# Altium schematic sheet ldr.SchDoc: DE:TMP:11:UC:EXPANDIDO
size 203 x 139 mm; Date: 21-07-2022; SheetNumber: 1; SheetTotal: 1; WebFGR: www.abebashop.com; VersionFGR: 20220721; PageSetup: Record=PageOptions|CenterHorizontal=True|CenterVertical=True|PrintScale=0.94|XCorrection=1.00|YCorrection=1.00|PrintKind=0|BorderSize=5000000|LeftOffset=0|BottomOffset=0|Orientation=2|PaperLength=1000|PaperWidth=1000|Scale=100|PaperSource=7|PrintQuality=-4|MediaType=1|DitherType=10|PaperKind=Letter|PrintScaleMode=1
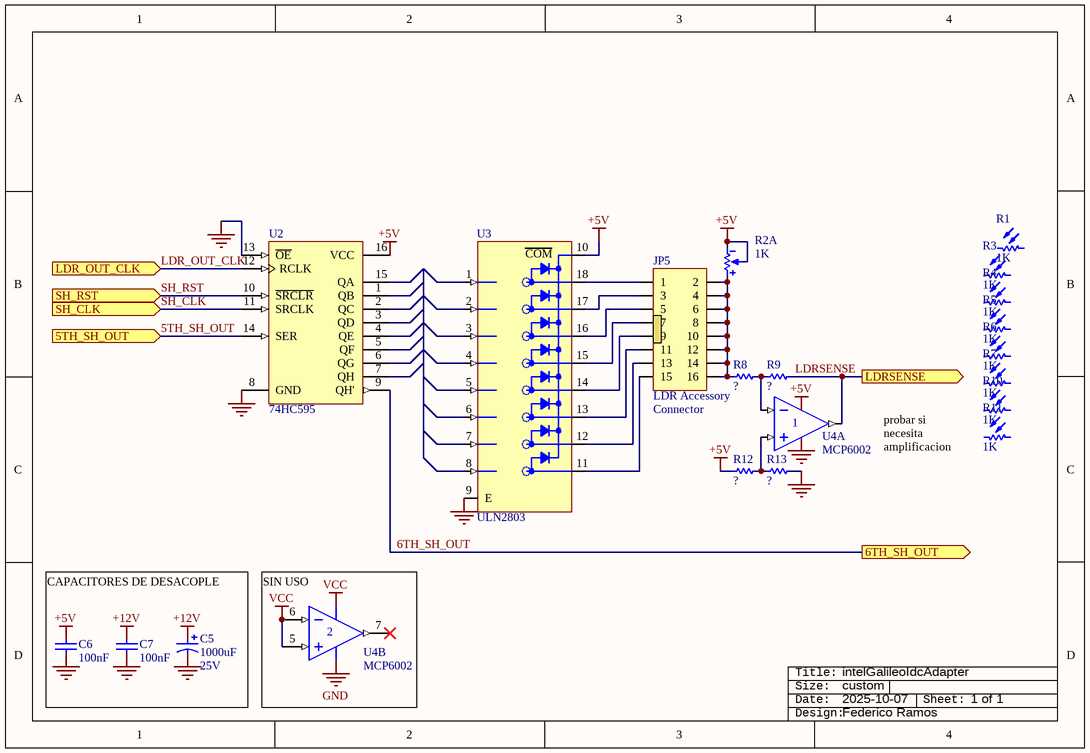
[diagram p0: ldr.SchDoc]

## Parts
C5  value 1000uF  Voltaje: 25V  [C_EL_6-3X11]  (hidden comment: Cap Pol)
C6  value 100nF  [c1206]  (hidden comment: Cap)
C7  value 100nF  [c1206]  (hidden comment: Cap)
JP5  IDC 8x2  [idc8x2]  (value not drawn)
R1  value 1K  [0805]  (hidden comment: LDR)
R2  value 1K  [conpol4x1]  (hidden comment: RVar)  (part A of 2)
R3  value 1K  [0805]  (hidden comment: LDR)
R4  value 1K  [0805]  (hidden comment: LDR)
R5  value 1K  [0805]  (hidden comment: LDR)
R6  value 1K  [0805]  (hidden comment: LDR)
R7  value 1K  [0805]  (hidden comment: LDR)
R8  Res  [R1206]  (value not drawn)
R9  Res  [R1206]  (value not drawn)
R10  value 1K  [0805]  (hidden comment: LDR)
R11  value 1K  [0805]  (hidden comment: LDR)
R12  Res  [R1206]  (value not drawn)
R13  Res  [R1206]  (value not drawn)
ROT?  Rotulo_empty  (value not drawn)  (graphical)
U2  74HC595  [DIP16]
U3  ULN2803  [DIP18Z]
U4  MCP6002  [dip8z]  (parts A,B of 2)

## Ports
5TH_SH_OUT (in), 6TH_SH_OUT (out), LDR_OUT_CLK (in), LDRSENSE (out), SH_CLK (in), SH_RST (in)

## Nets
+5V: C6.2 R2.2 R2.3 R12.2 U2.16(VCC) U3.10(~{COM}) U4.8(V+)
+12V: C5.1 C7.2
GND: C5.2 C6.1 C7.1 R13.1 U2.8(GND) U2.13(~{OE}) U3.9(E) U4.4(V-)
VCC: U4.5(IN+) U4.6(IN-) U4.8(V+)
5TH_SH_OUT: U2.14(SER) ; port 5TH_SH_OUT
6TH_SH_OUT: U2.9(QH') ; port 6TH_SH_OUT
LDR_OUT_CLK: U2.12(RCLK) ; port LDR_OUT_CLK
LDRSENSE: R9.1 U4.1(OUT) ; port LDRSENSE
SH_CLK: U2.11(SRCLK) ; port SH_CLK
SH_RST: U2.10(~{SRCLR}) ; port SH_RST
NetJP5_1: JP5.1 U3.18(~{C}1)
NetJP5_2: JP5.2 JP5.4 JP5.6 JP5.8 JP5.10 JP5.12 JP5.14 JP5.16 R2.1 R8.2
NetJP5_3: JP5.3 U3.17(~{C}2)
NetJP5_5: JP5.5 U3.16(~{C}3)
NetJP5_7: JP5.7 U3.15(~{C}4)
NetJP5_9: JP5.9 U3.14(~{C}5)
NetJP5_11: JP5.11 U3.13(~{C}6)
NetJP5_13: JP5.13 U3.12(~{C}7)
NetJP5_15: JP5.15 U3.11(~{C}8)
NetR8_1: R8.1 R9.2 U4.2(IN-)
NetR12_1: R12.1 R13.2 U4.3(IN+)

Not connected (* = marked no-connect by the designer): R1 1 2; R3 1 2; R4 1 2; R5 1 2; R6 1 2; R7 1 2; R10 1 2; R11 1 2; U2 1(QB) 2(QC) 3(QD) 4(QE) 5(QF) 6(QG) 7(QH) 15(QA); U3 1(B1) 2(B2) 3(B3) 4(B4) 5(B5) 6(B6) 7(B7) 8(B8); U4 7(OUT)*

## Notes on the sheet
- probar si necesita amplificacion
- CAPACITORES DE DESACOPLE
- (near U4) SIN USO
- intelGalileoIdcAdapter
- custom
- 2025-10-07
- (near ROT?) 1 of 1
- Federico Ramos
- (in symbol IDC 8x2) LDR Accessory; Connector
- (in symbol Rotulo_empty) Title:; Size:; Date:; Sheet:; Design:
- (in symbol ULN2803) COM

## Library data of the parts
C5 = Cap Pol: Capacitor Electrolítico; Price: ?
C6 C7 = Cap: Capacitor; Voltage: 50V; Price: 0.25; Technology: Ceramic
R1 R3-R7 R10 R11 = LDR: Resistor; Power: 0.25W; Price: 0.036
R2 = RVar: Resistencia Variable; Set Position: 0,5; Price: ?
R8 R9 R12 R13 = Res: Resistencia; Power: 0.25W; Price: 0.036; Value: ?
ROT? = Rotulo_empty: Rotulo [consolas]
U2 = 74HC595: 8-Bit Shift Register with 3-State Output Registers
U3 = ULN2803: Darlington Transistor Array; Price: 1.40
U4 = MCP6002: 1 MHz Bandwidth Low Power Op Amp
JP5 = IDC 8x2: Price: ?